# Altium schematic sheet Diagram.SchDoc
size A3; DrawnBy: ZEHRA; Engineer: ZEHRA; SheetNumber: 1; SheetTotal: 1; PageSize: A3; Department: R&D - Hardware
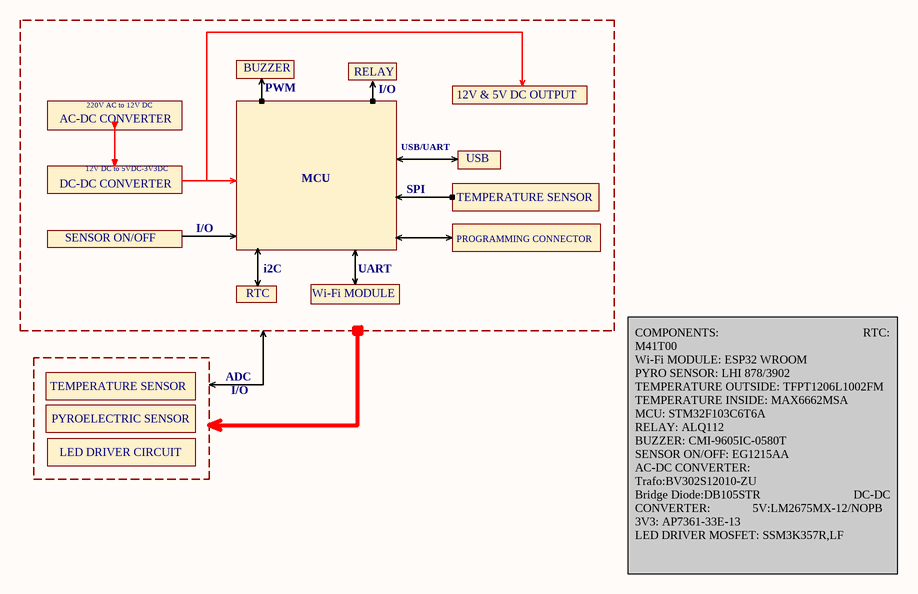
[diagram p0: Diagram.SchDoc]

## Notes on the sheet
- BUZZER
- PWM
- RELAY
- I/O
- 12V & 5V DC OUTPUT
- AC-DC CONVERTER
- 12V DC to 5VDC-3V3DC
- 220V AC to 12V DC
- USB/UART
- USB
- DC-DC CONVERTER
- MCU
- SPI
- TEMPERATURE SENSOR
- SENSOR ON/OFF
- RTC
- i2C
- Wi-Fi MODULE
- UART
- PROGRAMMING CONNECTOR
- PYROELECTRIC SENSOR
- ADC
- LED DRIVER CIRCUIT
- COMPONENTS:                                                RTC: M41T00                                                                                Wi-Fi MODULE: ESP32 WROOM                                                           PYRO SENSOR: LHI 878/3902                                                     TEMPERATURE OUTSIDE: TFPT1206L1002FM                                        TEMPERATURE INSIDE: MAX6662MSA                                                   MCU: STM32F103C6T6A                                                                     RELAY: ALQ112                                                                   BUZZER: CMI-9605IC-0580T                                                                    SENSOR ON/OFF: EG1215AA                                               AC-DC CONVERTER:                      Trafo:BV302S12010-ZU                                                                        Bridge Diode:DB105STR                               DC-DC CONVERTER:              5V:LM2675MX-12/NOPB                                                   3V3: AP7361-33E-13                                                 LED DRIVER MOSFET: SSM3K357R,LF
- FILE NAME
- Size
- Date:
- DrawnBy:
- Department
- Revision
- Sheet of
- File: